# EAGLE schematic RoboRio LED schematic (EAGLE 7.6.0)
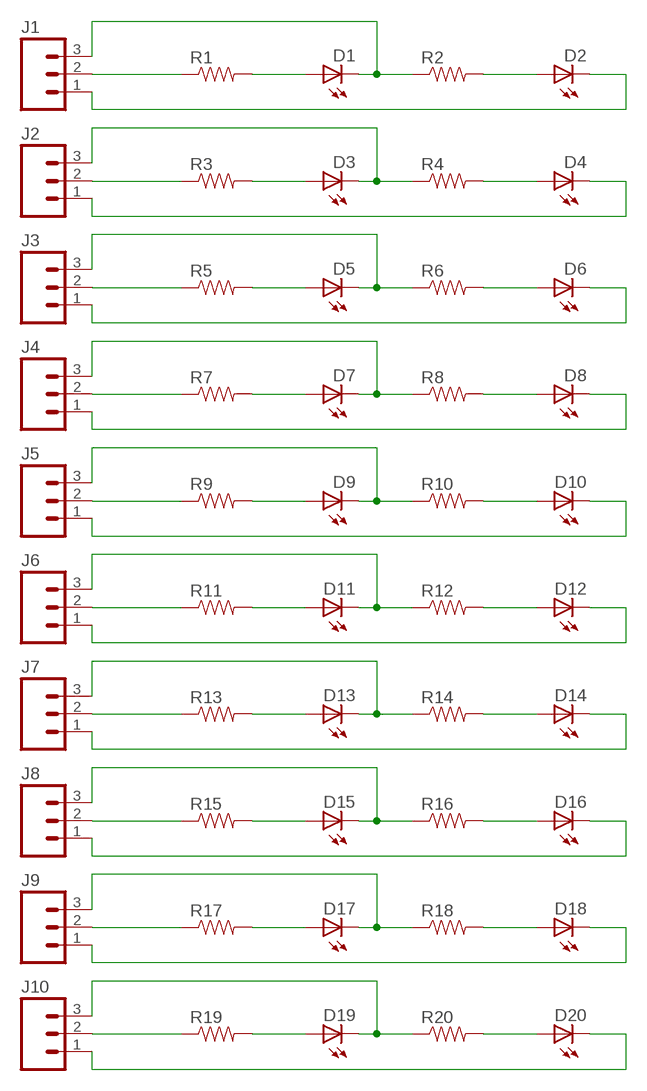
[diagram p0: schematic, sheet 1]

## Parts
D1  LED1206  [LED-1206]
D2  LED1206  [LED-1206]
D3  LED1206  [LED-1206]
D4  LED1206  [LED-1206]
D5  LED1206  [LED-1206]
D6  LED1206  [LED-1206]
D7  LED1206  [LED-1206]
D8  LED1206  [LED-1206]
D9  LED1206  [LED-1206]
D10  LED1206  [LED-1206]
D11  LED1206  [LED-1206]
D12  LED1206  [LED-1206]
D13  LED1206  [LED-1206]
D14  LED1206  [LED-1206]
D15  LED1206  [LED-1206]
D16  LED1206  [LED-1206]
D17  LED1206  [LED-1206]
D18  LED1206  [LED-1206]
D19  LED1206  [LED-1206]
D20  LED1206  [LED-1206]
J1  M03PTH  [1X03]
J2  M03PTH  [1X03]
J3  M03PTH  [1X03]
J4  M03PTH  [1X03]
J5  M03PTH  [1X03]
J6  M03PTH  [1X03]
J7  M03PTH  [1X03]
J8  M03PTH  [1X03]
J9  M03PTH  [1X03]
J10  M03PTH  [1X03]
R1  RESISTOR0603-RES  [0603-RES]
R2  RESISTOR0603-RES  [0603-RES]
R3  RESISTOR0603-RES  [0603-RES]
R4  RESISTOR0603-RES  [0603-RES]
R5  RESISTOR0603-RES  [0603-RES]
R6  RESISTOR0603-RES  [0603-RES]
R7  RESISTOR0603-RES  [0603-RES]
R8  RESISTOR0603-RES  [0603-RES]
R9  RESISTOR0603-RES  [0603-RES]
R10  RESISTOR0603-RES  [0603-RES]
R11  RESISTOR0603-RES  [0603-RES]
R12  RESISTOR0603-RES  [0603-RES]
R13  RESISTOR0603-RES  [0603-RES]
R14  RESISTOR0603-RES  [0603-RES]
R15  RESISTOR0603-RES  [0603-RES]
R16  RESISTOR0603-RES  [0603-RES]
R17  RESISTOR0603-RES  [0603-RES]
R18  RESISTOR0603-RES  [0603-RES]
R19  RESISTOR0603-RES  [0603-RES]
R20  RESISTOR0603-RES  [0603-RES]

## Nets
GND: D2.C J1.1
GND1: D4.C J2.1
GND2: D6.C J3.1
GND3: D8.C J4.1
GND4: D10.C J5.1
GND5: D12.C J6.1
GND6: D14.C J7.1
GND7: D16.C J8.1
GND8: D18.C J9.1
GND9: D20.C J10.1
N$1: J1.2 R1.1
N$2: D1.A R1.2
N$3: J2.2 R3.1
N$4: D2.A R2.2
N$5: D4.A R4.2
N$6: D3.A R3.2
N$7: J3.2 R5.1
N$8: D6.A R6.2
N$9: D5.A R5.2
N$10: J4.2 R7.1
N$11: D8.A R8.2
N$12: D7.A R7.2
N$13: J5.2 R9.1
N$14: D10.A R10.2
N$15: D9.A R9.2
N$16: J6.2 R11.1
N$17: D12.A R12.2
N$18: D11.A R11.2
N$19: J7.2 R13.1
N$20: D14.A R14.2
N$21: D13.A R13.2
N$22: J8.2 R15.1
N$23: D16.A R16.2
N$24: D15.A R15.2
N$25: J9.2 R17.1
N$26: D18.A R18.2
N$27: D17.A R17.2
N$28: J10.2 R19.1
N$29: D20.A R20.2
N$30: D19.A R19.2
S: D1.C J1.3 R2.1
S1: D3.C J2.3 R4.1
S2: D5.C J3.3 R6.1
S3: D7.C J4.3 R8.1
S4: D9.C J5.3 R10.1
S5: D11.C J6.3 R12.1
S6: D13.C J7.3 R14.1
S7: D15.C J8.3 R16.1
S8: D17.C J9.3 R18.1
S9: D19.C J10.3 R20.1

## Library data of the parts
D1-D20 = LilyPad-Wearables:LED: LEDs Standard schematic elements and footprints for 5mm, 3mm, 1206, and 0603 sized LEDs. 5mm - Spark Fun Electronics SKU : Comp-SBL
J1-J10 = SparkFun-Connectors:M03: Header 3 Standard 3-pin 0.1" header. Use with straight break away headers (SKU : PRT-00116), right angle break away headers (PRT-00553), swiss pins (PRT-00743), machine pins (PRT-00117), and female headers (PRT-00115). Molex polarized connector foot print use with SKU : PRT-08232 with associated crimp pins and housings.
R1-R20 = SparkFun-Passives:RESISTOR: Resistor Basic schematic elements and footprints for 0603, 1206, and PTH resistors.